# Altium project AQM_AI_Challenge_PCB.PrjPcb
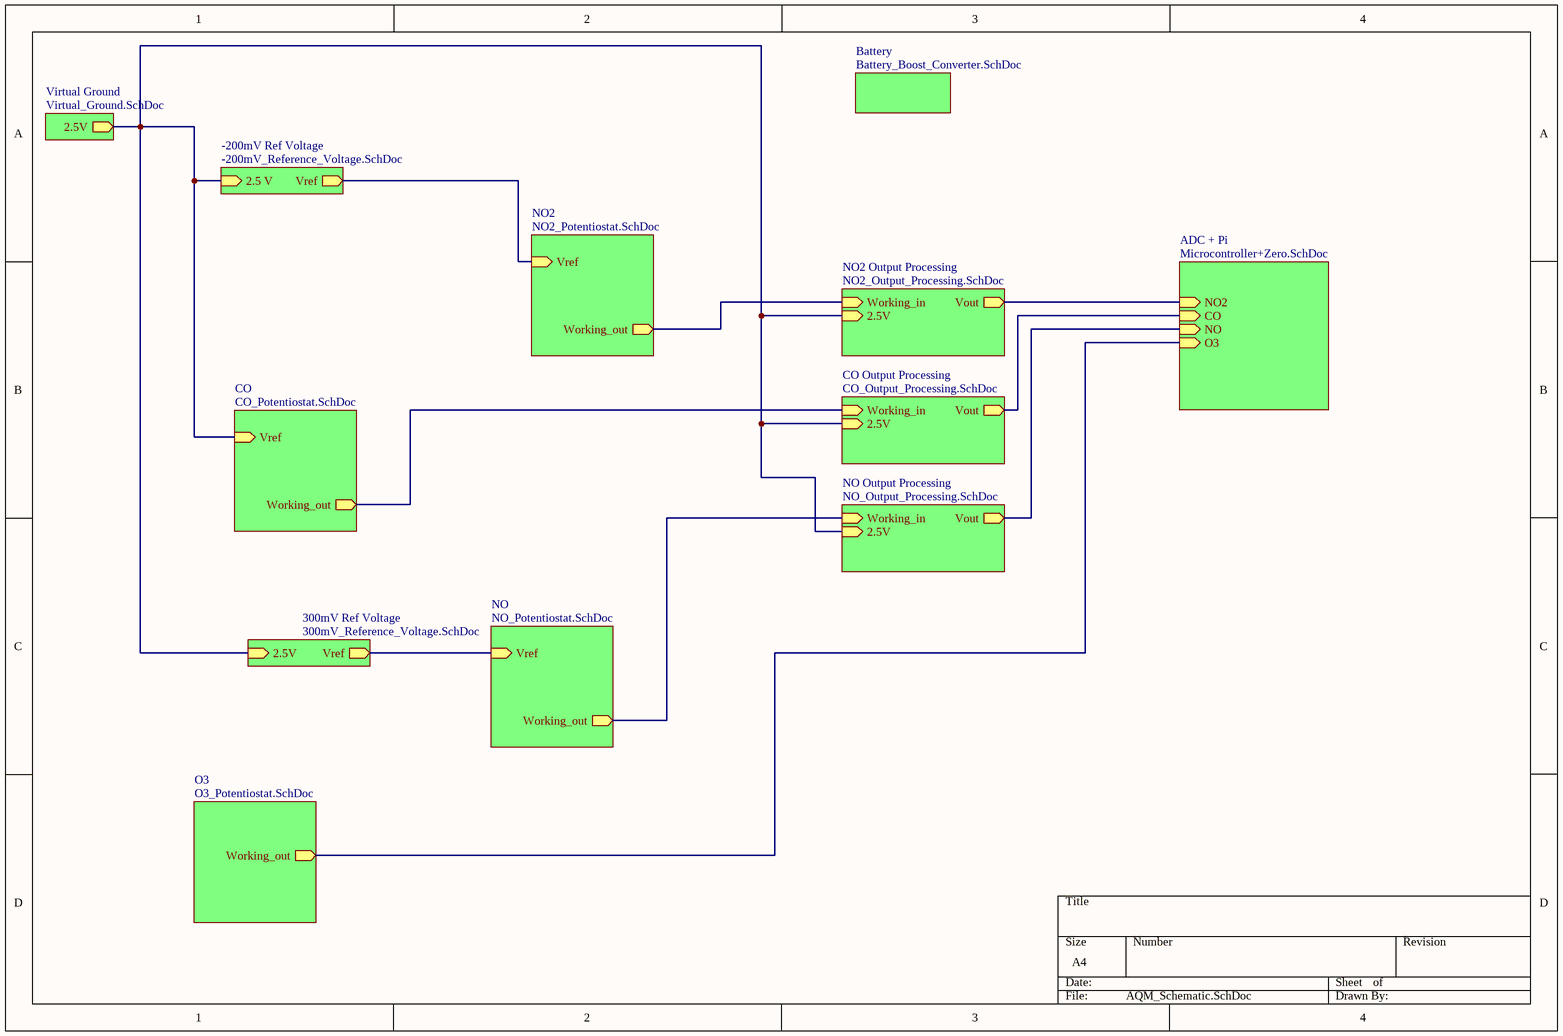
[diagram p0: AQM_Schematic.SchDoc]
13 sheets, 93 parts. Net scope: hierarchical (ports join the sheet entries above them; power ports are global).
Board file: AQM_PCB.PcbDoc
Sheets:
  AQM_Schematic.SchDoc
    -200mV Ref Voltage = -200mV_Reference_Voltage.SchDoc
    NO2 Output Processing = NO2_Output_Processing.SchDoc
    300mV Ref Voltage = 300mV_Reference_Voltage.SchDoc
    CO Output Processing = CO_Output_Processing.SchDoc
    NO Output Processing = NO_Output_Processing.SchDoc
    Virtual Ground = Virtual_Ground.SchDoc
    Battery = Battery_Boost_Converter.SchDoc
    NO2 = NO2_Potentiostat.SchDoc
    CO = CO_Potentiostat.SchDoc
    NO = NO_Potentiostat.SchDoc
    O3 = O3_Potentiostat.SchDoc
    ADC + Pi = Microcontroller+Zero.SchDoc

## Sheet AQM_Schematic.SchDoc
size A4

### Sub-sheets
300mV Ref Voltage = 300mV_Reference_Voltage.SchDoc: Vref (out), 2.5V (in)
-200mV Ref Voltage = -200mV_Reference_Voltage.SchDoc: Vref (out), 2.5 V (in)
ADC + Pi = Microcontroller+Zero.SchDoc: CO (in), NO (in), NO2 (in), O3 (in)
Battery = Battery_Boost_Converter.SchDoc: no entries
CO = CO_Potentiostat.SchDoc: Vref (in), Working_out (out)
CO Output Processing = CO_Output_Processing.SchDoc: Working_in (in), Vout (out), 2.5V (in)
NO = NO_Potentiostat.SchDoc: Vref (in), Working_out (out)
NO2 = NO2_Potentiostat.SchDoc: Vref (in), Working_out (out)
NO2 Output Processing = NO2_Output_Processing.SchDoc: Working_in (in), Vout (out), 2.5V (in)
NO Output Processing = NO_Output_Processing.SchDoc: Working_in (in), Vout (out), 2.5V (in)
O3 = O3_Potentiostat.SchDoc: Working_out (out)
Virtual Ground = Virtual_Ground.SchDoc: 2.5V (out)

### Nets
NetC6_1: sheet -200mV Ref Voltage/2.5 V, sheet NO2 Output Processing/2.5V, sheet 300mV Ref Voltage/2.5V, sheet CO Output Processing/2.5V, sheet NO Output Processing/2.5V, sheet Virtual Ground/2.5V, sheet CO/Vref
NetC6_2: sheet -200mV Ref Voltage/Vref, sheet NO2/Vref
NetC8_2: sheet NO2 Output Processing/Vout, sheet ADC + Pi/NO2
NetC10_2: sheet 300mV Ref Voltage/Vref, sheet NO/Vref
NetC12_2: sheet CO Output Processing/Vout, sheet ADC + Pi/CO
NetC15_2: sheet NO Output Processing/Vout, sheet ADC + Pi/NO
NetCO_Sensor_9: sheet CO Output Processing/Working_in, sheet CO/Working_out
NetNO2_Sensor_9: sheet NO2 Output Processing/Working_in, sheet NO2/Working_out
NetNO_Sensor_0: sheet NO Output Processing/Working_in, sheet NO/Working_out
NetR10_2: sheet O3/Working_out, sheet ADC + Pi/O3

## Sheet -200mV_Reference_Voltage.SchDoc
size A4
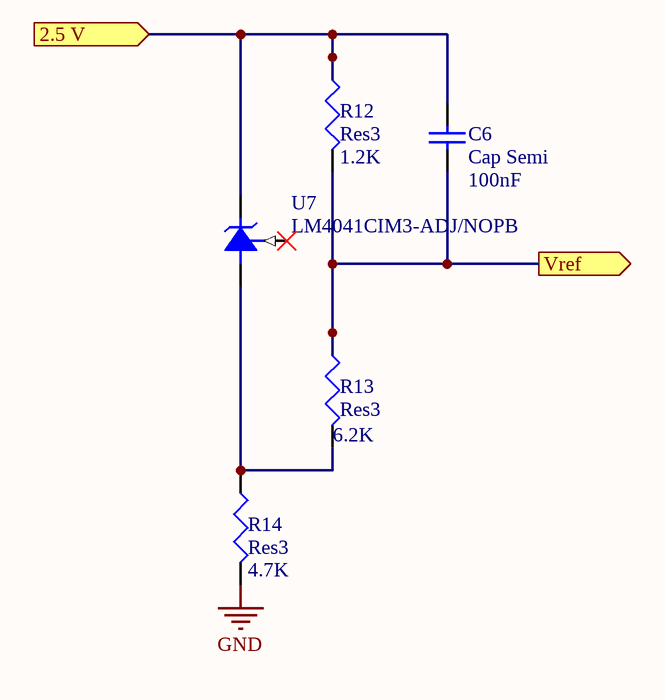
[diagram p1: -200mV_Reference_Voltage.SchDoc]

### Parts
C6  Cap Semi  value 100nF  [C1206]
R12  Res3  value 1.2K  [J1-0603]
R13  Res3  value 6.2K  [J1-0603]
R14  Res3  value 4.7K  [J1-0603]
U7  LM4041CIM3-ADJ/NOPB  [MF03A_M]

### Ports
2.5 V (in), Vref (out)

### Nets
GND: R14.1
NetC6_1: C6.1 R12.2 U7.2(+V) ; port 2.5 V
NetC6_2: C6.2 R12.1 R13.2 ; port Vref
NetR13_1: R13.1 R14.2 U7.3(-V)

Not connected (* = marked no-connect by the designer): U7 1(FB)*

### Library data of the parts
C6 = Cap Semi: Capacitor (Semiconductor SIM Model); Published: 8-Jun-2000; PackageReference: C1206; Publisher: Altium Limited; PackageDescription: Chip Capacitor; LatestRevisionDate: 29-May-2009; LatestRevisionNote: IPC-7351 Footprint Added.
R12-R14 = Res3: Resistor; Published: 8-Jun-2000; LatestRevisionDate: 29-May-2009; LatestRevisionNote: IPC-7351 Footprint Added.; PackageReference: J1-0603; Publisher: Altium Limited; PackageDescription: Chip Resistor
U7 = CMP-0074-00728-2: Precision Micropower Shunt Voltage Reference, 3-pin SOT-23, Pb-Free; Manufacturer: National Semiconductor; PowerWise: N; CompType: Voltage Reference IC; PackageTopMarking: RAC*XTT; DatasheetVersion: Mar-2005; PackageVersion: revB, Mar-2003; ComponentLink1URL: http://www.national.com/ds/LM/LM4041.pdf; RevisionNote: Component URLs added; RoHS: Y; PackageDescription: Molded SOT-23, .115 x .051 x .037in Body, 3 Lead, .075 in Pitch; ComponentLink1Description: LM4041 Datasheet; PackageReference: MF03A; ComponentLink2URL: http://www.national.com/pf/LM/LM4041.html; ComponentLink3URL: http://www.national.com/packaging/folders/mf03a.html; ComponentLink2Description: LM4041 Web Page; PinCount: 3; ComponentLink3Description: MF03A Package Page

## Sheet NO2_Output_Processing.SchDoc
size A4
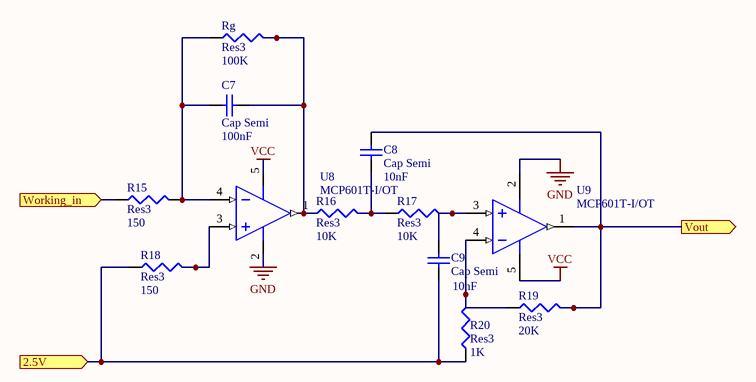
[diagram p2: NO2_Output_Processing.SchDoc]

### Parts
C7  Cap Semi  value 100nF  [C1206]
C8  Cap Semi  value 10nF  [C1206]
C9  Cap Semi  value 10nF  [C1206]
R15  Res3  value 150  [J1-0603]
R16  Res3  value 10K  [J1-0603]
R17  Res3  value 10K  [J1-0603]
R18  Res3  value 150  [J1-0603]
R19  Res3  value 20K  [J1-0603]
R20  Res3  value 1K  [J1-0603]
Rg  Res3  value 100K  [J1-0603]
U8  MCP601T-I/OT  [SOT-23-OT5_L]
U9  MCP601T-I/OT  [SOT-23-OT5_L]

### Ports
2.5V (in), Vout (out), Working_in (in)

### Nets
GND: U8.2(VSS) U9.2(VSS)
VCC: U8.5(VDD) U9.5(VDD)
NetC6_1: C9.1 R18.1 R20.1 ; port 2.5V
NetC7_1: C7.1 R15.2 Rg.1 U8.4(VIN-)
NetC7_2: C7.2 R16.1 Rg.2 U8.1(VOUT)
NetC8_1: C8.1 R16.2 R17.1
NetC8_2: C8.2 R19.2 U9.1(VOUT) ; port Vout
NetC9_2: C9.2 R17.2 U9.3(VIN+)
NetNO2_Sensor_9: R15.1 ; port Working_in
NetR18_2: R18.2 U8.3(VIN+)
NetR19_1: R19.1 R20.2 U9.4(VIN-)

### Library data of the parts
C7-C9 = Cap Semi: Capacitor (Semiconductor SIM Model); Published: 8-Jun-2000; LatestRevisionDate: 29-May-2009; LatestRevisionNote: IPC-7351 Footprint Added.; PackageReference: C1206; Publisher: Altium Limited; PackageDescription: Chip Capacitor
R15-R20 Rg = Res3: Resistor; Published: 8-Jun-2000; LatestRevisionDate: 29-May-2009; LatestRevisionNote: IPC-7351 Footprint Added.; PackageReference: J1-0603; Publisher: Altium Limited; PackageDescription: Chip Resistor
U8 U9 = CMP-0187-00433-2: 2.7V to 6.0V Single Supply CMOS Operational Amplifier, 5-Pin SOT-23, Industrial Temperature, Tape and Reel; Code_IPC: SOT23-5; ComponentLink3Description: Package Specification; RevisionNote: URLs added.; PackageReference: SOT-23-OT5; ComponentLink3URL: http://www.microchip.com/stellent/groups/techpub_sg/documents/packagingspec/en012702.pdf; ComponentLink1Description: Manufacturer URL; DatasheetVersion: revG, Dec-2007; PackageDescription: 5-Lead Plastic Small Outline Transistor (OT) [SOT-23]; PackageVersion: revBB, Aug-2009; ComponentLink2Description: Datasheet; ComponentLink1URL: http://www.microchip.com/; ComponentLink2URL: http://ww1.microchip.com/downloads/en/DeviceDoc/21314g.pdf

## Sheet 300mV_Reference_Voltage.SchDoc
size A4
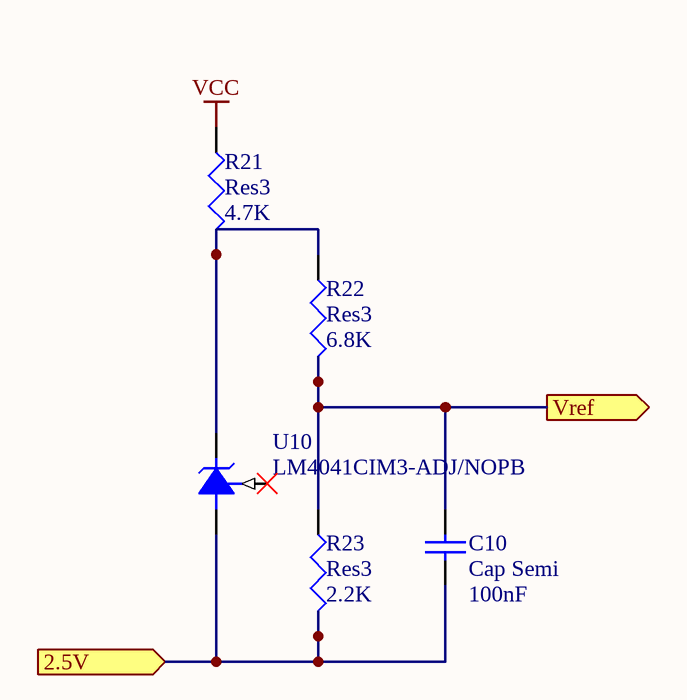
[diagram p3: 300mV_Reference_Voltage.SchDoc]

### Parts
C10  Cap Semi  value 100nF  [C1206]
R21  Res3  value 4.7K  [J1-0603]
R22  Res3  value 6.8K  [J1-0603]
R23  Res3  value 2.2K  [J1-0603]
U10  LM4041CIM3-ADJ/NOPB  [MF03A_M]

### Ports
2.5V (in), Vref (out)

### Nets
VCC: R21.1
NetC6_1: C10.1 R23.2 U10.3(-V) ; port 2.5V
NetC10_2: C10.2 R22.2 R23.1 ; port Vref
NetR21_2: R21.2 R22.1 U10.2(+V)

Not connected (* = marked no-connect by the designer): U10 1(FB)*

### Library data of the parts
C10 = Cap Semi: Capacitor (Semiconductor SIM Model); Published: 8-Jun-2000; LatestRevisionDate: 29-May-2009; LatestRevisionNote: IPC-7351 Footprint Added.; PackageReference: C1206; Publisher: Altium Limited; PackageDescription: Chip Capacitor
R21-R23 = Res3: Resistor; Published: 8-Jun-2000; LatestRevisionDate: 29-May-2009; LatestRevisionNote: IPC-7351 Footprint Added.; PackageReference: J1-0603; Publisher: Altium Limited; PackageDescription: Chip Resistor
U10 = CMP-0074-00728-2: as U7 on sheet -200mV_Reference_Voltage; DatasheetVersion: Mar-2005; PackageVersion: revB, Mar-2003; ComponentLink1URL: http://www.national.com/ds/LM/LM4041.pdf; RevisionNote: Component URLs added; RoHS: Y; PackageDescription: Molded SOT-23, .115 x .051 x .037in Body, 3 Lead, .075 in Pitch; ComponentLink1Description: LM4041 Datasheet; PackageReference: MF03A; ComponentLink2URL: http://www.national.com/pf/LM/LM4041.html; ComponentLink3URL: http://www.national.com/packaging/folders/mf03a.html; ComponentLink2Description: LM4041 Web Page; PinCount: 3; ComponentLink3Description: MF03A Package Page

## Sheet CO_Output_Processing.SchDoc
size A4
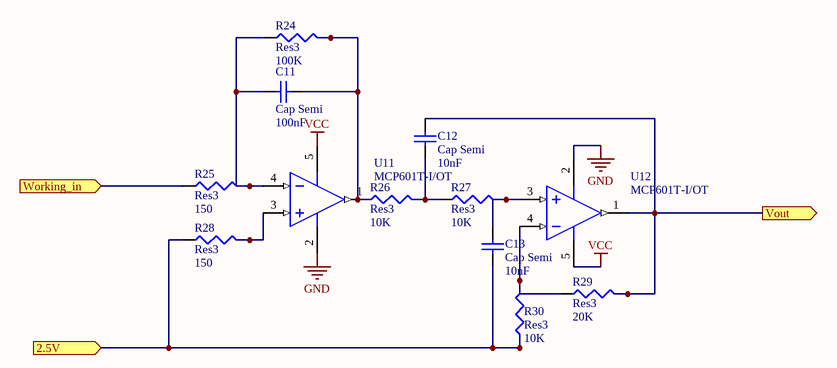
[diagram p4: CO_Output_Processing.SchDoc]

### Parts
C11  Cap Semi  value 100nF  [C1206]
C12  Cap Semi  value 10nF  [C1206]
C13  Cap Semi  value 10nF  [C1206]
R24  Res3  value 100K  [J1-0603]
R25  Res3  value 150  [J1-0603]
R26  Res3  value 10K  [J1-0603]
R27  Res3  value 10K  [J1-0603]
R28  Res3  value 150  [J1-0603]
R29  Res3  value 20K  [J1-0603]
R30  Res3  value 10K  [J1-0603]
U11  MCP601T-I/OT  [SOT-23-OT5_L]
U12  MCP601T-I/OT  [SOT-23-OT5_L]

### Ports
2.5V (in), Vout (out), Working_in (in)

### Nets
GND: U11.2(VSS) U12.2(VSS)
VCC: U11.5(VDD) U12.5(VDD)
NetC6_1: C13.1 R28.1 R30.1 ; port 2.5V
NetC11_1: C11.1 R24.1 R25.2 U11.4(VIN-)
NetC11_2: C11.2 R24.2 R26.1 U11.1(VOUT)
NetC12_1: C12.1 R26.2 R27.1
NetC12_2: C12.2 R29.2 U12.1(VOUT) ; port Vout
NetC13_2: C13.2 R27.2 U12.3(VIN+)
NetCO_Sensor_9: R25.1 ; port Working_in
NetR28_2: R28.2 U11.3(VIN+)
NetR29_1: R29.1 R30.2 U12.4(VIN-)

### Library data of the parts
C11-C13 = Cap Semi: Capacitor (Semiconductor SIM Model); Published: 8-Jun-2000; LatestRevisionDate: 29-May-2009; LatestRevisionNote: IPC-7351 Footprint Added.; PackageReference: C1206; Publisher: Altium Limited; PackageDescription: Chip Capacitor
R24-R30 = Res3: Resistor; Published: 8-Jun-2000; LatestRevisionDate: 29-May-2009; LatestRevisionNote: IPC-7351 Footprint Added.; PackageReference: J1-0603; Publisher: Altium Limited; PackageDescription: Chip Resistor
U11 U12 = CMP-0187-00433-2: as U8 on sheet NO2_Output_Processing; Code_IPC: SOT23-5; ComponentLink3Description: Package Specification; RevisionNote: URLs added.; PackageReference: SOT-23-OT5; ComponentLink3URL: http://www.microchip.com/stellent/groups/techpub_sg/documents/packagingspec/en012702.pdf; ComponentLink1Description: Manufacturer URL; DatasheetVersion: revG, Dec-2007; PackageDescription: 5-Lead Plastic Small Outline Transistor (OT) [SOT-23]; PackageVersion: revBB, Aug-2009; ComponentLink2Description: Datasheet; ComponentLink1URL: http://www.microchip.com/; ComponentLink2URL: http://ww1.microchip.com/downloads/en/DeviceDoc/21314g.pdf

## Sheet NO_Output_Processing.SchDoc
size A4
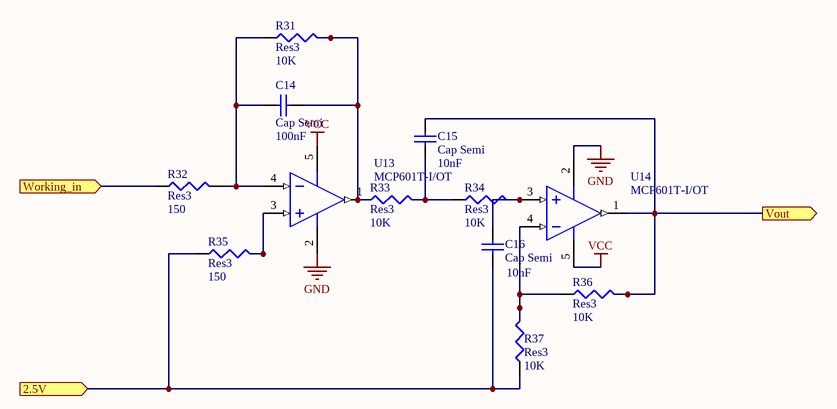
[diagram p5: NO_Output_Processing.SchDoc]

### Parts
C14  Cap Semi  value 100nF  [C1206]
C15  Cap Semi  value 10nF  [C1206]
C16  Cap Semi  value 10nF  [C1206]
R31  Res3  value 10K  [J1-0603]
R32  Res3  value 150  [J1-0603]
R33  Res3  value 10K  [J1-0603]
R34  Res3  value 10K  [J1-0603]
R35  Res3  value 150  [J1-0603]
R36  Res3  value 10K  [J1-0603]
R37  Res3  value 10K  [J1-0603]
U13  MCP601T-I/OT  [SOT-23-OT5_L]
U14  MCP601T-I/OT  [SOT-23-OT5_L]

### Ports
2.5V (in), Vout (out), Working_in (in)

### Nets
GND: U13.2(VSS) U14.2(VSS)
VCC: U13.5(VDD) U14.5(VDD)
NetC6_1: C16.1 R35.1 R37.1 ; port 2.5V
NetC14_1: C14.1 R31.1 R32.2 U13.4(VIN-)
NetC14_2: C14.2 R31.2 R33.1 U13.1(VOUT)
NetC15_1: C15.1 R33.2 R34.1
NetC15_2: C15.2 R36.2 U14.1(VOUT) ; port Vout
NetC16_2: C16.2 R34.2 U14.3(VIN+)
NetNO_Sensor_0: R32.1 ; port Working_in
NetR35_2: R35.2 U13.3(VIN+)
NetR36_1: R36.1 R37.2 U14.4(VIN-)

### Library data of the parts
C14-C16 = Cap Semi: Capacitor (Semiconductor SIM Model); Published: 8-Jun-2000; LatestRevisionDate: 29-May-2009; LatestRevisionNote: IPC-7351 Footprint Added.; PackageReference: C1206; Publisher: Altium Limited; PackageDescription: Chip Capacitor
R31-R37 = Res3: Resistor; Published: 8-Jun-2000; LatestRevisionDate: 29-May-2009; LatestRevisionNote: IPC-7351 Footprint Added.; PackageReference: J1-0603; Publisher: Altium Limited; PackageDescription: Chip Resistor
U13 U14 = CMP-0187-00433-2: as U8 on sheet NO2_Output_Processing; Code_IPC: SOT23-5; ComponentLink3Description: Package Specification; RevisionNote: URLs added.; PackageReference: SOT-23-OT5; ComponentLink3URL: http://www.microchip.com/stellent/groups/techpub_sg/documents/packagingspec/en012702.pdf; ComponentLink1Description: Manufacturer URL; DatasheetVersion: revG, Dec-2007; PackageDescription: 5-Lead Plastic Small Outline Transistor (OT) [SOT-23]; PackageVersion: revBB, Aug-2009; ComponentLink2Description: Datasheet; ComponentLink1URL: http://www.microchip.com/; ComponentLink2URL: http://ww1.microchip.com/downloads/en/DeviceDoc/21314g.pdf

## Sheet Virtual_Ground.SchDoc
size A4
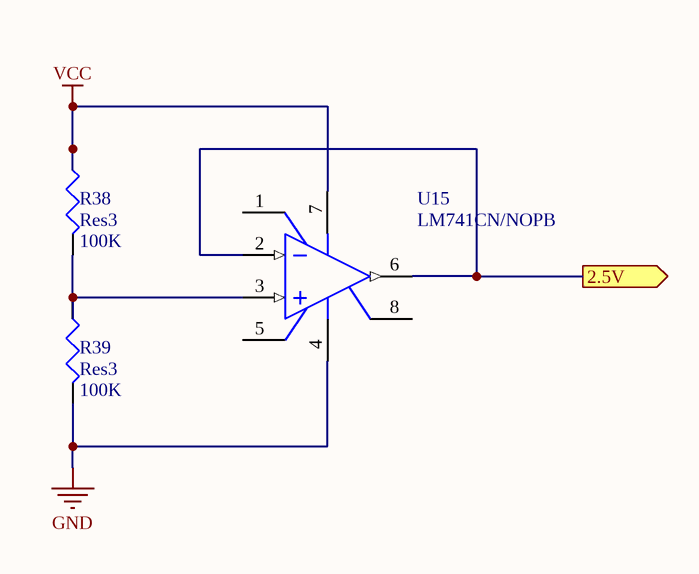
[diagram p6: Virtual_Ground.SchDoc]

### Parts
R38  Res3  value 100K  [J1-0603]
R39  Res3  value 100K  [J1-0603]
U15  LM741CN/NOPB  [P0008A]

### Ports
2.5V (out)

### Nets
GND: R39.1 U15.4(V-)
VCC: R38.2 U15.7(V+)
NetC6_1: U15.2(IN-) U15.6(OUT) ; port 2.5V
NetR38_1: R38.1 R39.2 U15.3(IN+)

Not connected (* = marked no-connect by the designer): U15 1(OFS_NULL) 5(OFS_NULL) 8(NC)

### Library data of the parts
R38 R39 = Res3: Resistor; Published: 8-Jun-2000; LatestRevisionDate: 29-May-2009; LatestRevisionNote: IPC-7351 Footprint Added.; PackageReference: J1-0603; Publisher: Altium Limited; PackageDescription: Chip Resistor
U15 = CMP-0055-00162-3: Operational Amplifier, 8-pin MDIP, Pb-Free; Manufacturer: Texas Instruments; PackageTopMarking: NSUZXYTTE#*LM*741CN; PowerWise: N; CompType: Amplifiers; ComponentLink1Description: Datasheet URL; ComponentLink1URL: http://www.ti.com/general/docs/lit/getliterature.tsp?genericPartNumber=LM741&fileType=pdf; PackageDescription: MDIP, .365 x .250 x .130in, 8 Lead, .100in Pitch; RoHS: Y; PinCount: 8; Code_JEDEC: MS-001-BA; Package Reference: P0008A

## Sheet Battery_Boost_Converter.SchDoc
size A4
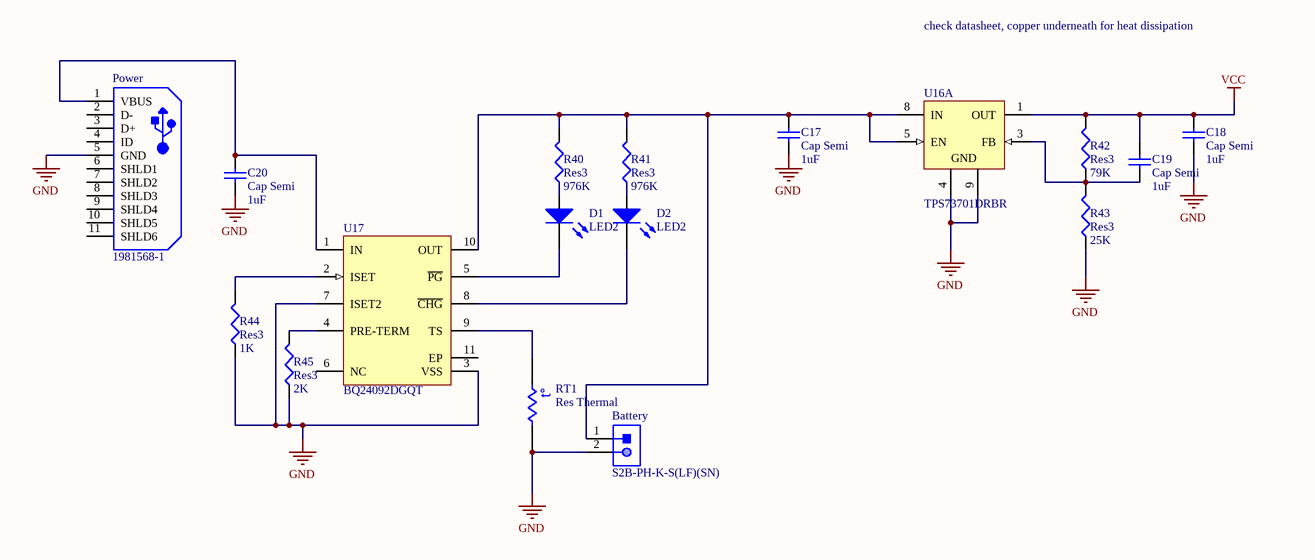
[diagram p7: Battery_Boost_Converter.SchDoc]

### Parts
Battery  S2B-PH-K-S(LF)(SN)  [JST-S2B-PH-K-S_V]
C17  Cap Semi  value 1uF  [C1206]
C18  Cap Semi  value 1uF  [C1206]
C19  Cap Semi  value 1uF  [C1206]
C20  Cap Semi  value 1uF  [C1206]
D1  LED2  [3.2X1.6X1.1]
D2  LED2  [3.2X1.6X1.1]
Power  1981568-1  [TECO-1981568-5_V]
R40  Res3  value 976K  [J1-0603]
R41  Res3  value 976K  [J1-0603]
R42  Res3  value 79K  [J1-0603]
R43  Res3  value 25K  [J1-0603]
R44  Res3  value 1K  [J1-0603]
R45  Res3  value 2K  [J1-0603]
RT1  Res Thermal  [6-0805_N]
U16  TPS73701DRBR  [DRB0008A_V]  (part A of 2)
U17  BQ24092DGQT  [DGQ0010D_L]

### Nets
GND: Battery.2 C17.1 C18.1 C20.1 Power.5(GND) R43.1 R44.1 R45.1 RT1.2 U16.4(GND) U16.9(GND) U17.3(VSS) U17.7(ISET2)
VCC: C18.2 C19.2 R42.2 U16.1(OUT)
NetBattery_1: Battery.1 C17.2 R40.2 R41.2 U16.5(EN) U16.8(IN) U17.10(OUT)
NetC19_1: C19.1 R42.1 R43.2 U16.3(FB)
NetC20_2: C20.2 Power.1(VBUS) U17.1(IN)
NetD1_1: D1.1(A) R40.1
NetD1_2: D1.2(K) U17.5(~{PG})
NetD2_1: D2.1(A) R41.1
NetD2_2: D2.2(K) U17.8(~{CHG})
NetR44_2: R44.2 U17.2(ISET)
NetR45_2: R45.2 U17.4(PRE-TERM)
NetRT1_1: RT1.1 U17.9(TS)

Not connected (* = marked no-connect by the designer): Power 2(D-) 3(D+) 4(ID) 6(SHLD1) 7(SHLD2) 8(SHLD3) 9(SHLD4) 10(SHLD5) 11(SHLD6); U17 6(NC) 11(EP)

### Notes on the sheet
- check datasheet, copper underneath for heat dissipation
- (in symbol Res Thermal) t°

### Library data of the parts
Battery = CMP-1755-00004-1: Male Header, Pitch 2 mm, 1 x 2 Position, Height 4.8 mm, Tail Length 3.4 mm, -25 to 85 degC, RoHS, Bulk; Case\Package: Radial; Tolerance: 20%; Capacitance: 10 uF; Voltage Rating (DC): 50 V; Packaging: Bulk; ComponentLink1URL: http://www.jst-mfg.com/product/pdf/eng/ePH.pdf; Radiation Hardening: No; Height: 11 mm; Package Quantity: 200; PackageDescription: Male Header, Pitch 2 mm, 1 x 2 Position, Height 4.8 mm, Tail Length 3.4 mm; PackageReference: S2B-PH-K-S; Diameter: 5 mm; Pins: 2; Mount: Through Hole; Max Operating Temperature: 85 degC; Min Operating Temperature: -40 degC; ComponentLink1Description: Datasheet; DatasheetVersion: Dec-12; Length: 11 mm; Lead Pitch: 2 mm; REACH SVHC: No SVHC; Voltage Rating: 50 V; RoHSCompliant: true
C17-C20 = Cap Semi: Capacitor (Semiconductor SIM Model); Published: 8-Jun-2000; LatestRevisionDate: 29-May-2009; LatestRevisionNote: IPC-7351 Footprint Added.; PackageReference: C1206; Publisher: Altium Limited; PackageDescription: Chip Capacitor
D1 D2 = LED2: Typical RED, GREEN, YELLOW, AMBER GaAs LED; Published: 8-Jun-2000; LatestRevisionDate: 17-Jul-2002; LatestRevisionNote: Re-released for DXP Platform.; PackageReference: 3.2X1.6X1.1; Publisher: Altium Limited; PackageDescription: SM LED; 2 Flat Leads; PackageVersion: Feb-2002
Power = CMP-2000-05408-1: Micro USB Receptacle Standard Type B Assy, 5-Pin SMD, RoHS, Tape and Reel; Manufacturer: TE Connectivity; Body Orientation: RightAngle; Number of Ports: 1Port; Number of Contacts: 5POS; Gender: RCP; Voltage Rating Max: 30VAC; Product Depth (mm): 5.6mm; Pitch (mm): 0.65mm; Current Rating (Max): 1/ContactA; Product Length (mm): 8mm; Product Height (mm): 3mm; Operating Temperature Max Deg. C: 85C; Datasheet URL: http://www.mouser.com/ds/2/418/NG_CD_1981568_E2-621296.pdf; Termination Method: Solder; Number of Terminals: 5; Operating Temp Range: -55Cto85C; Mounting Style: SurfaceMount; Manufacturer URL: http://www.te.com/; Contact Material: CopperAlloy; Packaging: TapeandReel; Datasheet Version: Rev. E2, 08/2015; Operating Temperature Min Deg. C: -55C; Housing Material: Thermoplastic; Type: MicroUSB; Contact Plating: GoldOverNickel
R40-R45 = Res3: Resistor; Published: 8-Jun-2000; LatestRevisionDate: 29-May-2009; LatestRevisionNote: IPC-7351 Footprint Added.; PackageReference: J1-0603; Publisher: Altium Limited; PackageDescription: Chip Resistor
RT1 = Res Thermal: Thermistor; Published: 24-Mar-1999; LatestRevisionDate: 29-May-2009; LatestRevisionNote: IPC-7351 Footprint Added.; PackageVersion: Mar-2003; PackageReference: 6-0805; Publisher: Altium Limited; PackageDescription: Chip Resistor 0805 Case Size; Code_IPC: RESC2012
U16 = CMP-0395-00601-2: Single Output LDO, 1 A, Adjustable 1.2 to 5.5 V Output, 2.2 to 5.5 V Input, with Reverse Current Protection, 8-pin SON (DRB), -40 to 125 degC, Green (RoHS & no Sb/Br); Manufacturer: Texas Instruments; Rating: Catalog; Vdo(Typ)(mV): 130; Iout(Max)(A): 1; Vout Adj(Max)(V): 5.5; Iq(Typ)(mA): 0.3; SubFamily: Single Channel LDO; Vout Adj(Min)(V): 1.2; Accuracy(%): 3; Vin(Min)(V): 2.2; PackageReference: DRB0008A; PackageDescription: 8-Pin Plastic Small Outline, Body 3 x 3 mm, Pitch 0.65 mm; ComponentLink3URL: http://www.ti.com/litv/pdf/mpds118h; Eco-Plan: Green (RoHS & no Sb/Br); ComponentLink1Description: Manufacturer URL; ComponentLink2URL: http://www.ti.com/general/docs/lit/getliterature.tsp?genericPartNumber=TPS73701&fileType=pdf; ComponentLink1URL: http://www.ti.com/; PackageVersion: 4203482-2/K; DatasheetVersion: SBVS067O; ComponentLink2Description: Datasheet; Mounting Technology: Surface Mount; ComponentLink3Description: Package Specification; PartNumber: TPS73701DRBR; Vin(Max)(V): 5.5
U17 = CMP-0321-00905-2: 1 A, Single-Input, Single-Cell Li-Ion Battery Charger with Operation Over JEITA and 10 k ohm NTC, 4.5 V, -40 to 150 degC, 10-pin MSOP-PowerPAD (DGQ), Green (RoHS & no Sb/Br); Manufacturer: Texas Instruments; Over Voltage Protection: N; SubFamily: Battery Charge Management; Vin(Min)(V): 4.5; Eco-Plan: Green (RoHS & no Sb/Br); DatasheetVersion: SLUS968C; ComponentLink1URL: http://www.ti.com/general/docs/lit/getliterature.tsp?genericPartNumber=BQ24092&fileType=pdf; NiMH: N; Lead Acid: N; Li-Ion: N; Mounting Technology: Surface Mount; NiCd: N; PackageVersion: revF, Nov-2011; Code_JEDEC: MO-187-BA-T; ComponentLink1Description: Datasheet; PartNumber: BQ24092DGQT; Li-Polymer: N; PackageDescription: 10-Pin PowerPAD Plastic Small Outline 0.5 mm Pitch, Exposed Pad; PackageReference: DGQ0010D

## Sheet NO2_Potentiostat.SchDoc
size A4
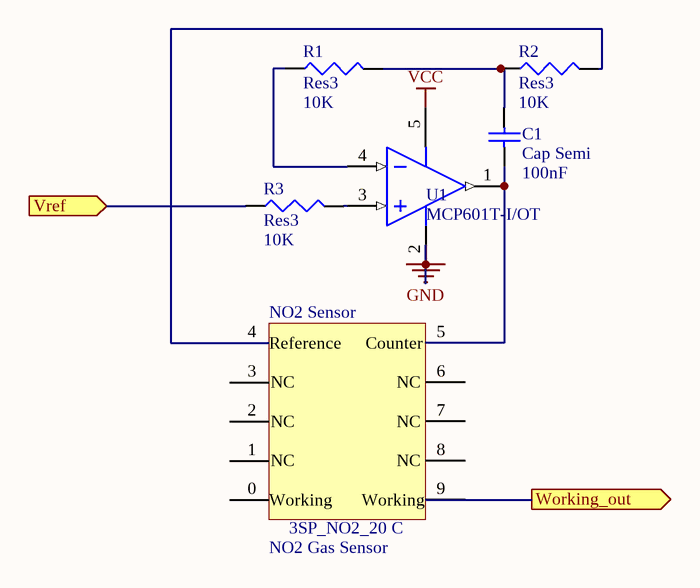
[diagram p8: NO2_Potentiostat.SchDoc]

### Parts
C1  Cap Semi  value 100nF  [C1206]
NO2_Sensor  NO2 Gas Sensor  [Spec_Sensor]
R1  Res3  value 10K  [J1-0603]
R2  Res3  value 10K  [J1-0603]
R3  Res3  value 10K  [J1-0603]
U1  MCP601T-I/OT  [SOT-23-OT5_L]

### Ports
Vref (in), Working_out (out)

### Nets
GND: U1.2(VSS)
VCC: U1.5(VDD)
NetC1_1: C1.1 NO2_Sensor.5(Counter) U1.1(VOUT)
NetC1_2: C1.2 R1.2 R2.1
NetC6_2: R3.1 ; port Vref
NetNO2_Sensor_4: NO2_Sensor.4(Reference) R2.2
NetNO2_Sensor_9: NO2_Sensor.9(Working) ; port Working_out
NetR1_1: R1.1 U1.4(VIN-)
NetR3_2: R3.2 U1.3(VIN+)

Not connected (* = marked no-connect by the designer): NO2_Sensor 0(Working) 1(NC) 2(NC) 3(NC) 6(NC) 7(NC) 8(NC)

### Notes on the sheet
- (in symbol 3SP_NO2_5F C) 3SP_NO2_20 C

### Library data of the parts
C1 = Cap Semi: Capacitor (Semiconductor SIM Model); Published: 8-Jun-2000; LatestRevisionDate: 29-May-2009; LatestRevisionNote: IPC-7351 Footprint Added.; PackageReference: C1206; Publisher: Altium Limited; PackageDescription: Chip Capacitor
NO2_Sensor = 3SP_NO2_5F C: 3SP_NO2_5F C Package 110-508
R1-R3 = Res3: Resistor; Published: 8-Jun-2000; LatestRevisionDate: 29-May-2009; LatestRevisionNote: IPC-7351 Footprint Added.; PackageReference: J1-0603; Publisher: Altium Limited; PackageDescription: Chip Resistor
U1 = CMP-0187-00433-2: as U8 on sheet NO2_Output_Processing; Code_IPC: SOT23-5; ComponentLink3Description: Package Specification; RevisionNote: URLs added.; PackageReference: SOT-23-OT5; ComponentLink3URL: http://www.microchip.com/stellent/groups/techpub_sg/documents/packagingspec/en012702.pdf; ComponentLink1Description: Manufacturer URL; DatasheetVersion: revG, Dec-2007; PackageDescription: 5-Lead Plastic Small Outline Transistor (OT) [SOT-23]; PackageVersion: revBB, Aug-2009; ComponentLink2Description: Datasheet; ComponentLink1URL: http://www.microchip.com/; ComponentLink2URL: http://ww1.microchip.com/downloads/en/DeviceDoc/21314g.pdf

## Sheet CO_Potentiostat.SchDoc
size A4
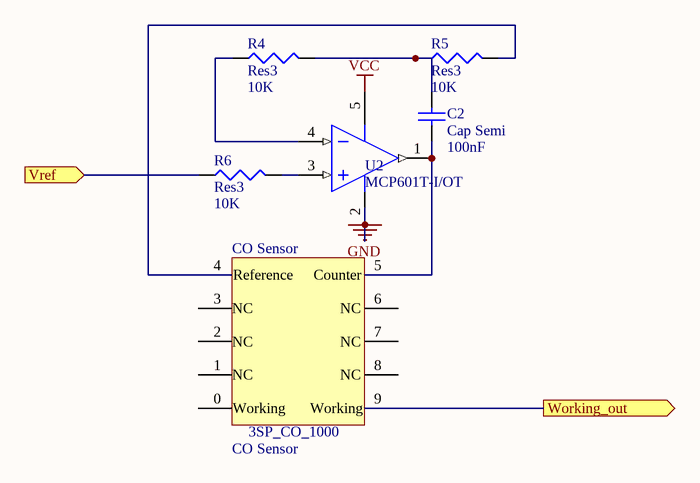
[diagram p9: CO_Potentiostat.SchDoc]

### Parts
C2  Cap Semi  value 100nF  [C1206]
CO_Sensor  CO Sensor  [Spec_Sensor]
R4  Res3  value 10K  [J1-0603]
R5  Res3  value 10K  [J1-0603]
R6  Res3  value 10K  [J1-0603]
U2  MCP601T-I/OT  [SOT-23-OT5_L]

### Ports
Vref (in), Working_out (out)

### Nets
GND: U2.2(VSS)
VCC: U2.5(VDD)
NetC2_1: C2.1 CO_Sensor.5(Counter) U2.1(VOUT)
NetC2_2: C2.2 R4.2 R5.1
NetC6_1: R6.1 ; port Vref
NetCO_Sensor_4: CO_Sensor.4(Reference) R5.2
NetCO_Sensor_9: CO_Sensor.9(Working) ; port Working_out
NetR4_1: R4.1 U2.4(VIN-)
NetR6_2: R6.2 U2.3(VIN+)

Not connected (* = marked no-connect by the designer): CO_Sensor 0(Working) 1(NC) 2(NC) 3(NC) 6(NC) 7(NC) 8(NC)

### Library data of the parts
C2 = Cap Semi: Capacitor (Semiconductor SIM Model); Published: 8-Jun-2000; LatestRevisionDate: 29-May-2009; LatestRevisionNote: IPC-7351 Footprint Added.; PackageReference: C1206; Publisher: Altium Limited; PackageDescription: Chip Capacitor
CO_Sensor = 3SP_CO_1000: 3SP_CO_1000 Package 110-109
R4-R6 = Res3: Resistor; Published: 8-Jun-2000; LatestRevisionDate: 29-May-2009; LatestRevisionNote: IPC-7351 Footprint Added.; PackageReference: J1-0603; Publisher: Altium Limited; PackageDescription: Chip Resistor
U2 = CMP-0187-00433-2: as U8 on sheet NO2_Output_Processing; Code_IPC: SOT23-5; ComponentLink3Description: Package Specification; RevisionNote: URLs added.; PackageReference: SOT-23-OT5; ComponentLink3URL: http://www.microchip.com/stellent/groups/techpub_sg/documents/packagingspec/en012702.pdf; ComponentLink1Description: Manufacturer URL; DatasheetVersion: revG, Dec-2007; PackageDescription: 5-Lead Plastic Small Outline Transistor (OT) [SOT-23]; PackageVersion: revBB, Aug-2009; ComponentLink2Description: Datasheet; ComponentLink1URL: http://www.microchip.com/; ComponentLink2URL: http://ww1.microchip.com/downloads/en/DeviceDoc/21314g.pdf

## Sheet NO_Potentiostat.SchDoc
size A4
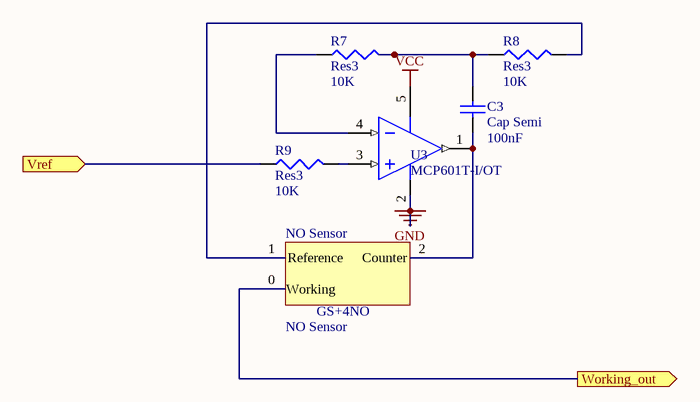
[diagram p10: NO_Potentiostat.SchDoc]

### Parts
C3  Cap Semi  value 100nF  [C1206]
NO_Sensor  NO Sensor  [NO_Sensor]
R7  Res3  value 10K  [J1-0603]
R8  Res3  value 10K  [J1-0603]
R9  Res3  value 10K  [J1-0603]
U3  MCP601T-I/OT  [SOT-23-OT5_L]

### Ports
Vref (in), Working_out (out)

### Nets
GND: U3.2(VSS)
VCC: U3.5(VDD)
NetC3_1: C3.1 NO_Sensor.2(Counter) U3.1(VOUT)
NetC3_2: C3.2 R7.2 R8.1
NetC10_2: R9.1 ; port Vref
NetNO_Sensor_0: NO_Sensor.0(Working) ; port Working_out
NetNO_Sensor_1: NO_Sensor.1(Reference) R8.2
NetR7_1: R7.1 U3.4(VIN-)
NetR9_2: R9.2 U3.3(VIN+)

### Library data of the parts
C3 = Cap Semi: Capacitor (Semiconductor SIM Model); Published: 8-Jun-2000; LatestRevisionDate: 29-May-2009; LatestRevisionNote: IPC-7351 Footprint Added.; PackageReference: C1206; Publisher: Altium Limited; PackageDescription: Chip Capacitor
NO_Sensor = GS+4NO
R7-R9 = Res3: Resistor; Published: 8-Jun-2000; LatestRevisionDate: 29-May-2009; LatestRevisionNote: IPC-7351 Footprint Added.; PackageReference: J1-0603; Publisher: Altium Limited; PackageDescription: Chip Resistor
U3 = CMP-0187-00433-2: as U8 on sheet NO2_Output_Processing; Code_IPC: SOT23-5; ComponentLink3Description: Package Specification; RevisionNote: URLs added.; PackageReference: SOT-23-OT5; ComponentLink3URL: http://www.microchip.com/stellent/groups/techpub_sg/documents/packagingspec/en012702.pdf; ComponentLink1Description: Manufacturer URL; DatasheetVersion: revG, Dec-2007; PackageDescription: 5-Lead Plastic Small Outline Transistor (OT) [SOT-23]; PackageVersion: revBB, Aug-2009; ComponentLink2Description: Datasheet; ComponentLink1URL: http://www.microchip.com/; ComponentLink2URL: http://ww1.microchip.com/downloads/en/DeviceDoc/21314g.pdf

## Sheet O3_Potentiostat.SchDoc
size A4
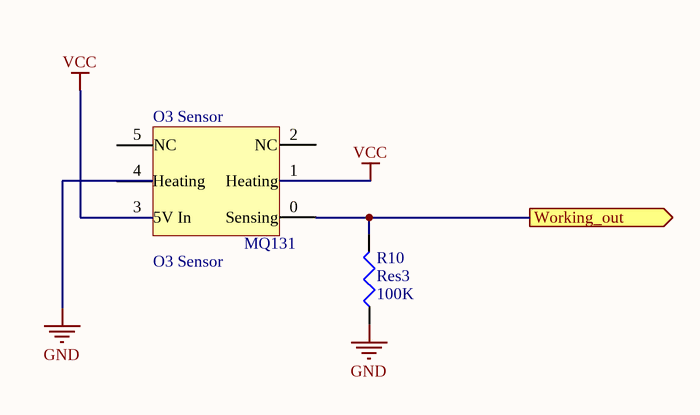
[diagram p11: O3_Potentiostat.SchDoc]

### Parts
O3_Sensor  O3 Sensor  [O3_Sensor]
R10  Res3  value 100K  [J1-0603]

### Ports
Working_out (out)

### Nets
GND: O3_Sensor.4(Heating) R10.1
VCC: O3_Sensor.1(Heating) O3_Sensor.3(5V_In)
NetR10_2: R10.2 ; port Working_out

Not connected (* = marked no-connect by the designer): O3_Sensor 0(Sensing) 2(NC) 5(NC)

### Library data of the parts
O3_Sensor = MQ131
R10 = Res3: Resistor; Published: 8-Jun-2000; LatestRevisionDate: 29-May-2009; LatestRevisionNote: IPC-7351 Footprint Added.; PackageReference: J1-0603; Publisher: Altium Limited; PackageDescription: Chip Resistor

## Sheet Microcontroller+Zero.SchDoc
size A4
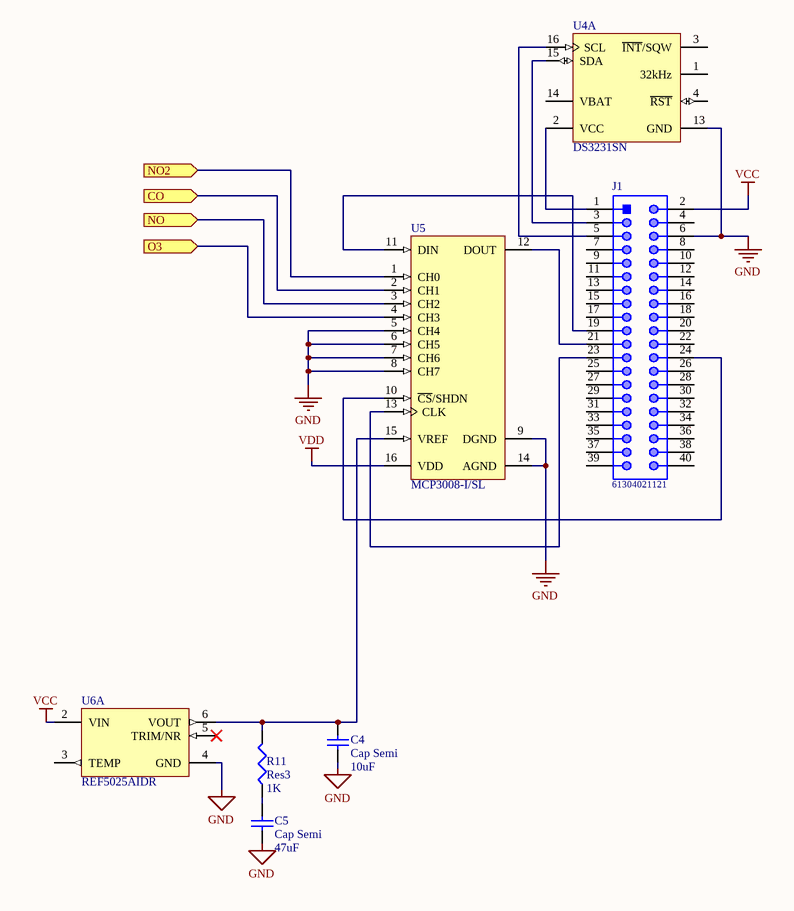
[diagram p12: Microcontroller+Zero.SchDoc]

### Parts
C4  Cap Semi  value 10uF  [C1206]
C5  Cap Semi  value 47uF  [C1206]
J1  61304021121  [61304021121]
R11  Res3  value 1K  [J1-0603]
U4  DS3231SN  [W16-H2_L]  (part A of 2)
U5  MCP3008-I/SL  [SOIC-SL16_L]
U6  REF5025AIDR  [D0008A_L]  (part A of 2)

### Ports
CO (in), NO2 (in), NO (in), O3 (in)

### Nets
GND: C4.1 C5.1 J1.6 U4.13(GND) U5.5(CH4) U5.6(CH5) U5.7(CH6) U5.8(CH7) U5.9(DGND) U5.14(AGND) U6.4(GND)
VCC: J1.2 U6.2(VIN)
VDD: U5.16(VDD)
NetC4_2: C4.2 R11.2 U5.15(VREF) U6.6(VOUT)
NetC5_2: C5.2 R11.1
NetC8_2: U5.1(CH0) ; port NO2
NetC12_2: U5.2(CH1) ; port CO
NetC15_2: U5.3(CH2) ; port NO
NetJ1_1: J1.1 U4.2(VCC)
NetJ1_3: J1.3 U4.15(SDA)
NetJ1_5: J1.5 U4.16(SCL)
NetJ1_19: J1.19 U5.11(DIN)
NetJ1_21: J1.21 U5.12(DOUT)
NetJ1_23: J1.23 U5.13(CLK)
NetJ1_24: J1.24 U5.10(~{CS}/SHDN)
NetR10_2: U5.4(CH3) ; port O3

Not connected (* = marked no-connect by the designer): J1 4 7 8 9 10 11 12 13 14 15 16 17 18 20 22 25 26 27 28 29 30 31 32 33 34 35 36 37 38 39 40; U4 1(32kHz) 3(~{INT}/SQW) 4(~{RST}) 14(VBAT); U6 3(TEMP) 5(TRIM/NR)*

### Library data of the parts
C4 C5 = Cap Semi: Capacitor (Semiconductor SIM Model); Published: 8-Jun-2000; LatestRevisionDate: 29-May-2009; LatestRevisionNote: IPC-7351 Footprint Added.; PackageReference: C1206; Publisher: Altium Limited; PackageDescription: Chip Capacitor
J1 = CMP-1502-01135-1: THT Vertical Pin Header WR-PHD, Pitch 2.54 mm, Dual Row, 40 pins; Manufacturer: Wurth Elektronik; Contact Resistance: 20mOhm; Pitch: 2.54mm; Pin Number: 40; Withstanding Voltage: 500VAC; Gender: Male; Rated Current: 3A; Working Voltage: 250VAC; Operating Temperature: -40to105degC; Manufacturer URL: http://www.we-online.de; Orientation: Vertical; Datasheet URL: https://katalog.we-online.de/em/datasheet/6130xx21121.pdf; Package Reference: 61304021121; Row Number: Dual; Part Number: 61304021121; Packaging: Bag; Mounting Technology: THT; Publisher: WurthElektronik
R11 = Res3: Resistor; Published: 8-Jun-2000; LatestRevisionDate: 29-May-2009; LatestRevisionNote: IPC-7351 Footprint Added.; PackageReference: J1-0603; Publisher: Altium Limited; PackageDescription: Chip Resistor
U4 = CMP-0254-00293-1: Extremely Accurate I2C-Integrated Real-Time Clock/TCXO/Crystal, 16-Pin SO, -40 to 85 degC; ComponentLink1Description: Manufacturer URL; ComponentLink3URL: http://pdfserv.maxim-ic.com/package_dwgs/21-0042.PDF; ComponentLink3Description: Package Specification; PackageVersion: revD, 2010; ComponentLink2URL: http://datasheets.maxim-ic.com/en/ds/DS3231.pdf; ComponentLink2Description: Datasheet; PackageReference: W16-H2; Code_JEDEC: MS-013-AA; ComponentLink1URL: http://www.maxim-ic.com; PackageDescription: 16-Pin Small-Outline IC, Wide (0.3in), 1.27 mm Pitch, SOIC (W); Code_IPC: SOIC127P1030-16; DatasheetVersion: Rev 8, Jul-2010
U5 = CMP-0188-00041-2: 2.7V 4-Channel/8-Channel 10-Bit A/D Converters with SPI Serial Interface, 16-Pin SOIC 150mil, Industrial Temperature; ComponentLink1URL: http://www.microchip.com/; ComponentLink3Description: Package Specification; PackageDescription: 16-Lead Plastic Small Outline (SL) - Narrow, 3.90mm Body [SOIC]; PackageVersion: revBB, Aug-2009; ComponentLink2Description: Datasheet; Code_IPC: SOIC127P600-16; RevisionNote: URLs added.; ComponentLink3URL: http://www.microchip.com/stellent/groups/techpub_sg/documents/packagingspec/en012702.pdf; ComponentLink1Description: Manufacturer URL; ComponentLink2URL: http://ww1.microchip.com/downloads/en/DeviceDoc/21295d.pdf; Code_JEDEC: MS-012-AC; DatasheetVersion: revD, Dec-2008; PackageReference: SOIC-SL16
U6 = CMP-0367-00041-2: Low Noise, Very Low Drift, Precision Voltage Reference, -40 to 125 degC, 8-pin SOIC (D), Green (RoHS & no Sb/Br); Manufacturer: Texas Instruments; VO(V): 2.5; Iout/Iz(Max)(mA): 10; Initial Accuracy @ 25/deg C(%): 0.05; VI(Max)(V): 18; Iq(Max)(uA): 1000; Rating: Military; Temp Coeff(Max)(ppm/ degree C): 3; SubFamily: Series Voltage Reference; VI(Min)(V): 2.7; DatasheetVersion: SBOS410E; Eco-Plan: Green (RoHS & no Sb/Br); ComponentLink2URL: http://www.ti.com/general/docs/lit/getliterature.tsp?genericPartNumber=REF5025&fileType=pdf; PackageVersion: 4040047-3/M; PackageDescription: 8-Pin Plastic Small Outline, Body 4.9 x 3.9 mm, Pitch 1.27 mm; PartNumber: REF5025AIDR; ComponentLink3Description: Package Specification; ComponentLink1URL: http://www.ti.com/; ComponentLink1Description: Manufacturer URL; PackageReference: D0008A; ComponentLink3URL: http://www.ti.com/litv/pdf/msoi002j; Mounting Technology: Surface Mount; ComponentLink2Description: Datasheet; Code_JEDEC: MS-012

## Nets that join several sheets
GND: -200mV_Reference_Voltage (R14.1), NO2_Output_Processing (U8.2 U9.2), CO_Output_Processing (U11.2 U12.2), NO_Output_Processing (U13.2 U14.2), Virtual_Ground (R39.1 U15.4), Battery_Boost_Converter (13 pins), NO2_Potentiostat (U1.2), CO_Potentiostat (U2.2), NO_Potentiostat (U3.2), O3_Potentiostat (O3_Sensor.4 R10.1), Microcontroller+Zero (11 pins)
VCC: NO2_Output_Processing (U8.5 U9.5), 300mV_Reference_Voltage (R21.1), CO_Output_Processing (U11.5 U12.5), NO_Output_Processing (U13.5 U14.5), Virtual_Ground (R38.2 U15.7), Battery_Boost_Converter (C18.2 C19.2 R42.2 U16.1), NO2_Potentiostat (U1.5), CO_Potentiostat (U2.5), NO_Potentiostat (U3.5), O3_Potentiostat (O3_Sensor.1 O3_Sensor.3), Microcontroller+Zero (J1.2 U6.2)
NetC6_1: -200mV_Reference_Voltage (C6.1 R12.2 U7.2), NO2_Output_Processing (C9.1 R18.1 R20.1), 300mV_Reference_Voltage (C10.1 R23.2 U10.3), CO_Output_Processing (C13.1 R28.1 R30.1), NO_Output_Processing (C16.1 R35.1 R37.1), Virtual_Ground (U15.2 U15.6), CO_Potentiostat (R6.1)
NetC6_2: -200mV_Reference_Voltage (C6.2 R12.1 R13.2), NO2_Potentiostat (R3.1)
NetC8_2: NO2_Output_Processing (C8.2 R19.2 U9.1), Microcontroller+Zero (U5.1)
NetC10_2: 300mV_Reference_Voltage (C10.2 R22.2 R23.1), NO_Potentiostat (R9.1)
NetC12_2: CO_Output_Processing (C12.2 R29.2 U12.1), Microcontroller+Zero (U5.2)
NetC15_2: NO_Output_Processing (C15.2 R36.2 U14.1), Microcontroller+Zero (U5.3)
NetCO_Sensor_9: CO_Output_Processing (R25.1), CO_Potentiostat (CO_Sensor.9)
NetNO2_Sensor_9: NO2_Output_Processing (R15.1), NO2_Potentiostat (NO2_Sensor.9)
NetNO_Sensor_0: NO_Output_Processing (R32.1), NO_Potentiostat (NO_Sensor.0)
NetR10_2: O3_Potentiostat (R10.2), Microcontroller+Zero (U5.4)